# EAGLE design hackspace_con (EAGLE 9.6.2)
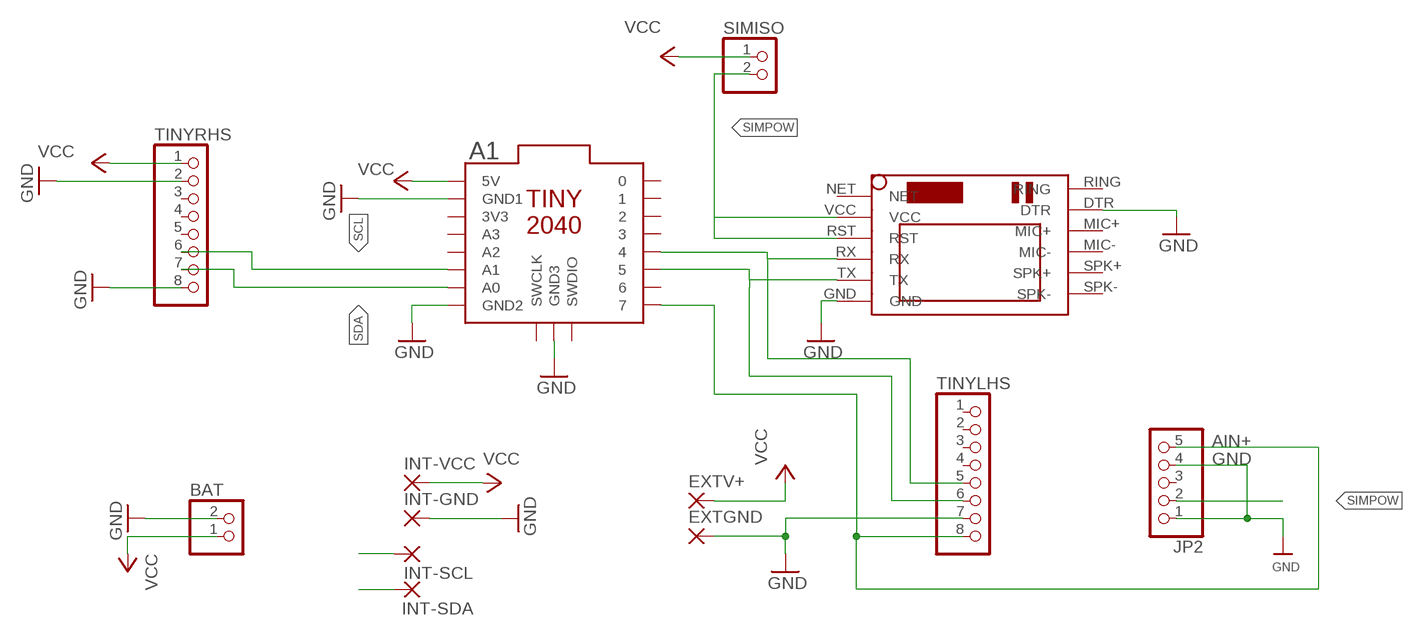
[diagram p0: schematic, sheet 1]

## Parts
A1  TINY2040  [TINY2040]
BAT  JST_2PIN-THM-RA  [JST-PH-2-THM-RA]
EXTGND  SMD5  [SMD2,54-5,08]
EXTV+  SMD5  [SMD2,54-5,08]
INT-GND  3,17/1,1  [3,17/1,1]
INT-SCL  3,17/1,1  [3,17/1,1]
INT-SDA  3,17/1,1  [3,17/1,1]
INT-VCC  3,17/1,1  [3,17/1,1]
JP2  HEADER-1X570MIL  [1X05_ROUND_70]
SIMISO  PINHD-1X2  [1X02]
TINYLHS  PINHD-1X8  [1X08]
TINYRHS  PINHD-1X8  [1X08]
U$1  SIM800LMODULE  [SIM800LMODULE]

## Nets
AIN+: A1.7 JP2.5 TINYLHS.8
GND: A1.GND1 A1.GND2 A1.GND3 BAT.2 EXTGND.1(P) INT-GND.1(P) JP2.1 JP2.4 TINYLHS.7 TINYRHS.2 TINYRHS.8 U$1.DTR U$1.GND
RX: A1.4 TINYLHS.5 U$1.RX
SCL: A1.A1 INT-SCL.1(P) TINYRHS.6
SDA: A1.A0 INT-SDA.1(P) TINYRHS.7
SIMPOW: JP2.2 SIMISO.2 U$1.RST U$1.VCC
TX: A1.5 TINYLHS.6 U$1.TX
VCC: A1.5V BAT.1 EXTV+.1(P) INT-VCC.1(P) SIMISO.1 TINYRHS.1
Unconnected: A1.0 A1.1 A1.2 A1.3 A1.3V3 A1.6 A1.A2 A1.A3 A1.SWCLK A1.SWDIO JP2.3 TINYLHS.1 TINYLHS.2 TINYLHS.3 TINYLHS.4 TINYRHS.3 TINYRHS.4 TINYRHS.5 U$1.MIC+ U$1.MIC- U$1.NET U$1.RING U$1.SPK+ U$1.SPK-

## Library data of the parts
A1 = pimoroni-boards:TINY2040
BAT = adafruit:JST_2PIN: JST 2-Pin Connectors of various flavors SMT-RA (S2B-PH-SM4) 4UConnector #17311 SMT (B2B-PH-SM4) THM-RA (S2B-PH) THM (B2B-PH)
EXTGND EXTV+ = wirepad:SMD5: SMD PAD
INT-GND INT-SCL INT-SDA INT-VCC = wirepad:3,17/1,1: THROUGH-HOLE PAD
JP2 = microbuilder:HEADER-1X5: PIN HEADER
SIMISO = pinhead:PINHD-1X2: PIN HEADER
TINYLHS TINYRHS = pinhead:PINHD-1X8: PIN HEADER
U$1 = SIM800LMODULE:SIM800LMODULE: SIM800L Module

## Board
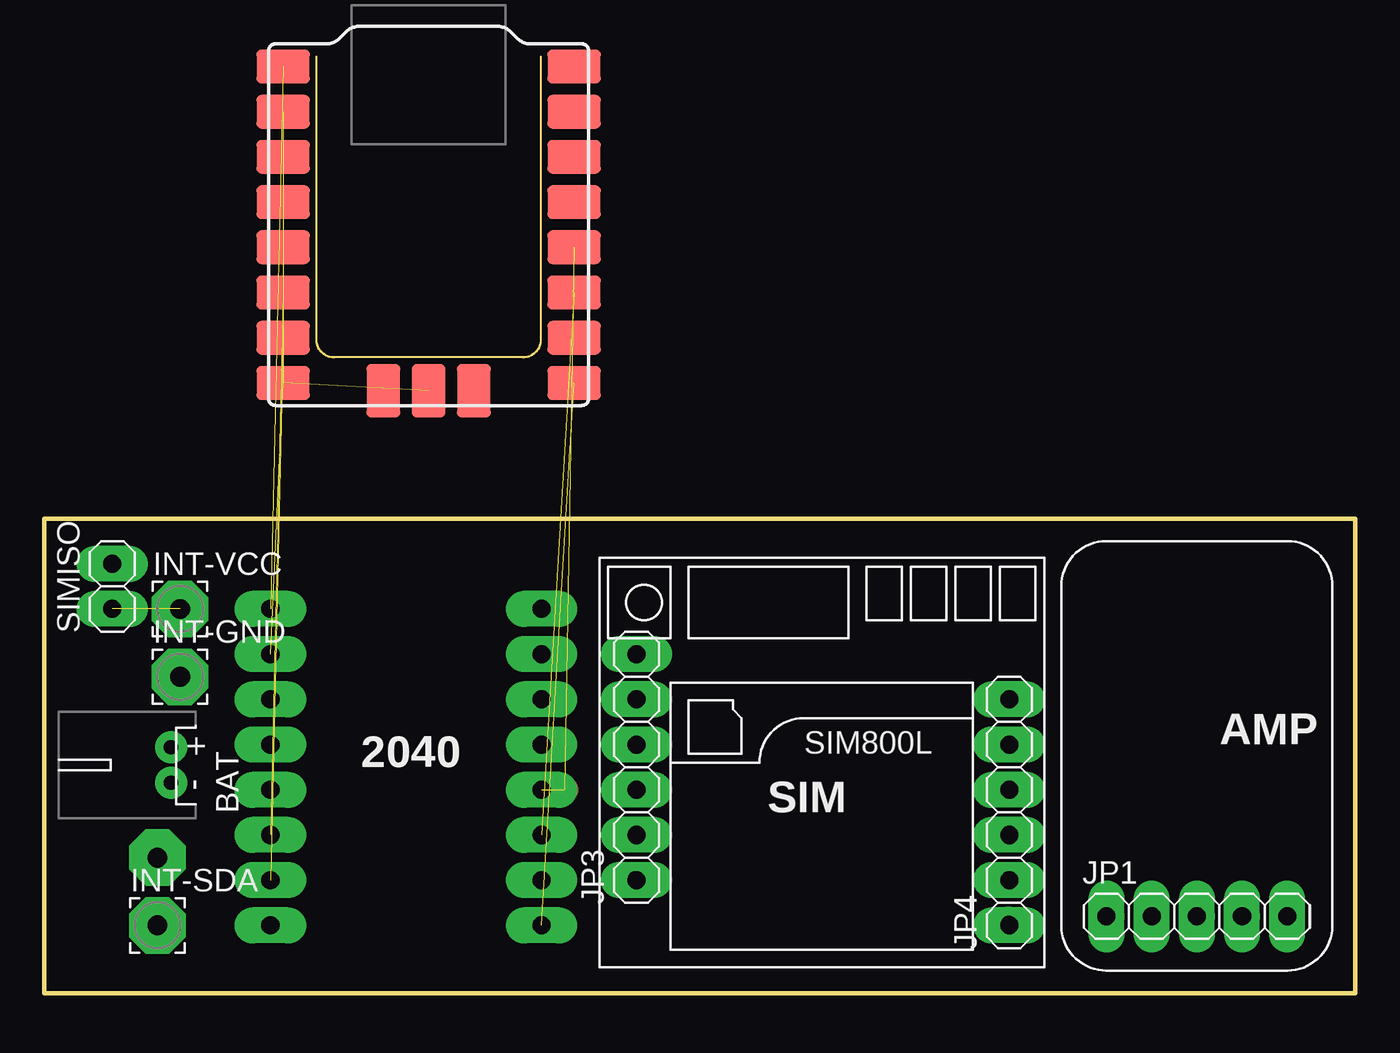
[diagram p1: board, top side]
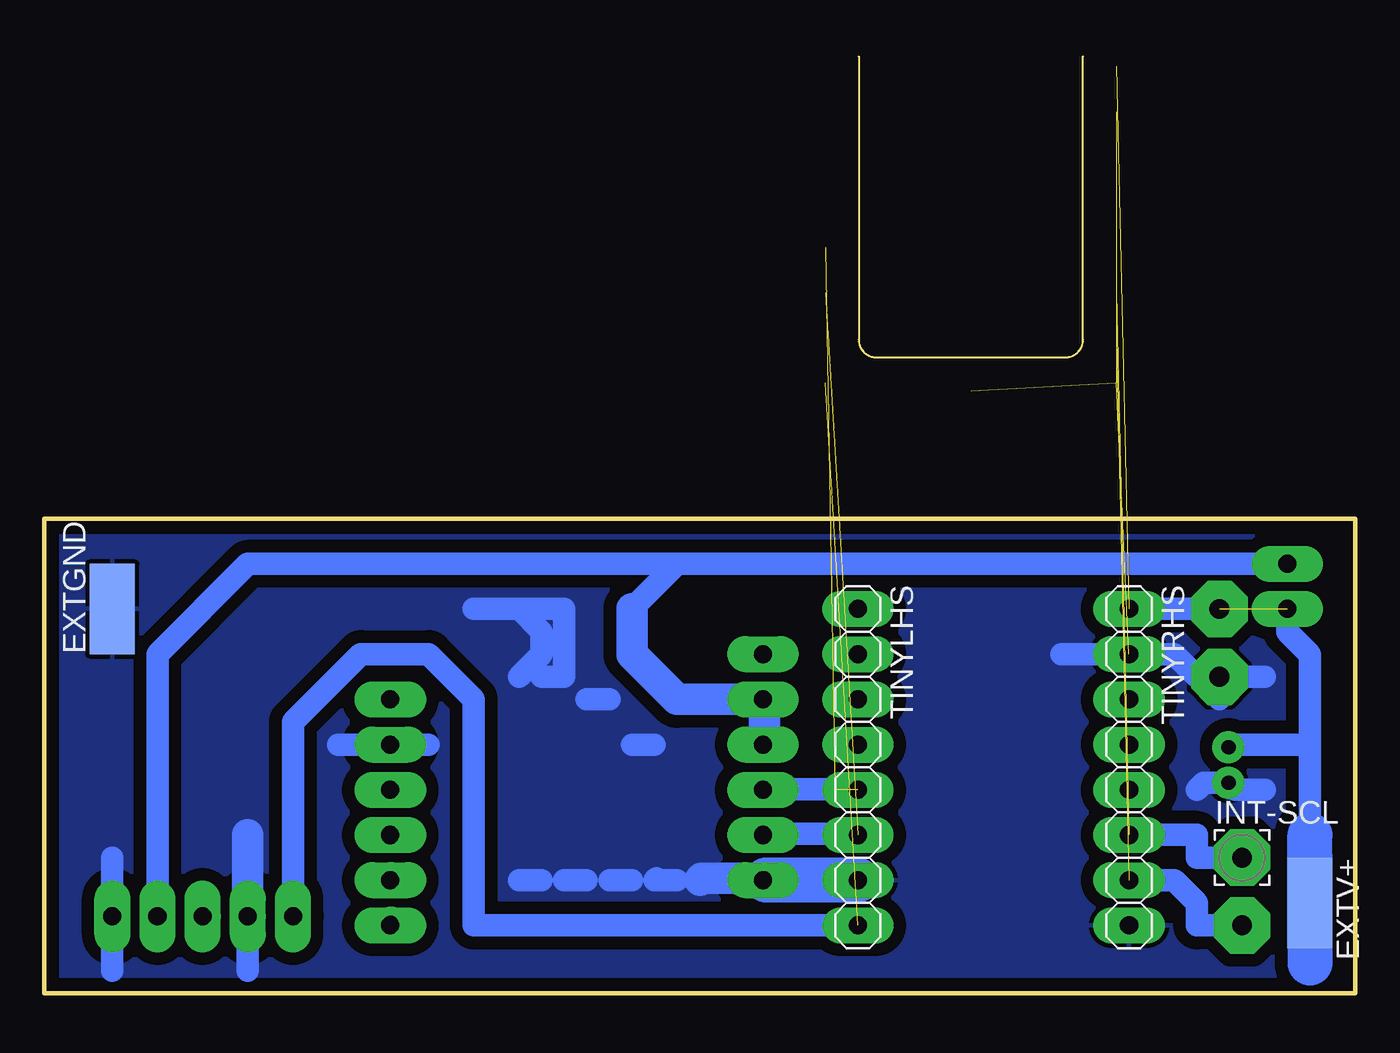
[diagram p2: board, bottom side, seen from below]

Size 73.66 x 26.67 mm. Coordinates in mm from the lower left corner, seen from the top.
Outline: 0,26.67 0,0 73.66,0 73.66,26.67 0,26.67
Copper layers (1*16): Top 0.035mm / dielectric 1.5mm / Bottom 0.035mm
Design rules "aisler_2_layer_simple *": minimum track width 0.1mm, minimum drill 0.3mm, track to track 0.1mm, track to pad 0.1mm, pad to pad 0.1mm, via to via 0.1mm, smd to smd 0.1mm, copper to edge 0.3mm, drill to drill 0.25mm, minimum pad ring 0.5mm, minimum via ring 0.2mm, stop-mask expansion 0mil, vias tented up to drill 0mil, thermal gap 10mil

### Footprints (pad centres in the part's own frame; a part is rotated, then mirrored left to right if it is on the bottom)
TINY2040 = smd 1.9 x 3: 0 1.27,8.17; 1 3.81,8.17; 2 6.35,8.17; 3 8.89,8.17; 3V3 6.35,-8.17; 4 11.43,8.17; 5 13.97,8.17; 5V 1.27,-8.17; 6 16.51,8.17; 7 19.05,8.17; A0 16.51,-8.17; A1 13.97,-8.17; A2 11.43,-8.17; A3 8.89,-8.17; GND1 3.81,-8.17; GND2 19.05,-8.17 | smd 3 x 1.9: GND3 19.49,0; SWCLK 19.49,-2.54; SWDIO 19.49,2.54
JST-PH-2-THM-RA = drill 0.8 pad 1.422: 1 1,0; 2 -1,0
SMD2,54-5,08 = smd 2.54 x 5.08: 1 0,0
3,17/1,1 = drill 1.118 pad 3.175 octagon: 1 0,0
1X05 = drill 1.016 long: 1 -5.08,0; 2 -2.54,0; 3 0,0; 4 2.54,0; 5 5.08,0
1X05_ROUND_70 = drill 1 pad 1.778 square: 1 -5.08,0 | drill 1 pad 1.778: 2 -2.54,0; 3 0,0; 4 2.54,0; 5 5.08,0
1X06 = drill 1.016 long: 1 -6.35,0; 2 -3.81,0; 3 -1.27,0; 4 1.27,0; 5 3.81,0; 6 6.35,0
1X02 = drill 1.016 long: 1 -1.27,0; 2 1.27,0
1X08 = drill 1.016 long: 1 -8.89,0; 2 -6.35,0; 3 -3.81,0; 4 -1.27,0; 5 1.27,0; 6 3.81,0; 7 6.35,0; 8 8.89,0
SIM800LMODULE = drill 0.8: DTR 10.5,1; GND -10.5,-6.5; MIC+ 10.5,-1.5; MIC- 10.5,-4; RST -10.5,1; RX -10.5,-1.5; SPK+ 10.5,-6.5; SPK- 10.5,-9; TX -10.5,-4; VCC -10.5,3.5 | drill 0.8 square: NET -10.5,6; RING 10.5,3.5

### Placement (x,y rotation side)
A1  21.59,53.34 270 top  (outside the outline)
BAT  7.11,12.83 90 top
EXTGND  69.85,21.59 0 bottom
EXTV+  2.54,5.08 180 bottom
INT-GND  7.62,17.78 0 top
INT-SCL  6.35,7.62 0 bottom
INT-SDA  6.35,3.81 0 top
INT-VCC  7.62,21.59 0 top
JP1  [1X05]  64.77,4.32 0 top
JP2  64.77,4.32 180 top
JP3  [1X06]  33.27,12.7 90 top
JP4  [1X06]  54.23,10.16 90 top
SIMISO  3.81,22.86 90 top
TINYLHS  27.94,12.7 270 bottom
TINYRHS  12.7,12.7 270 bottom
U$1  43.69,12.95 0 top

### Tracks (layer width: path | path; a pad name or v marks a point on that pad's centre or on a via)
AIN+  (1 unrouted)
  Bottom 1.27: JP2.5 59.69,15.24 55.88,19.05 52.07,19.05 49.53,16.51 49.53,3.81 TINYLHS.8
GND  (3 unrouted)
  Bottom 1.27: JP2.4 62.23,5.08 | JP2.4 62.23,2.54 | U$1.GND 33.08,6.35 31.75,6.35 | 5.08,11.43 6.71,11.43 BAT.2 8.49,11.83 8.89,11.43 | 16.51,19.05 TINYRHS.2 10.16,19.05 8.89,17.78 INT-GND.1 | INT-GND.1 5.08,17.78 | INT-GND.1 7.62,16.51 | 52.07,13.97 52.09,13.95 U$1.DTR 54.2,13.97 57.15,13.97 | JP2.4 62.23,1.27 | 69.85,1.27 JP2.1 69.85,7.62 | 46.99,21.59 45.72,20.32 45.72,19.05 46.99,17.78 | 46.99,21.59 49.53,21.59 | 46.99,6.35 45.72,6.35 | 45.72,17.78 44.45,17.78 44.45,21.59 46.99,21.59 | 44.45,6.35 43.18,6.35 | 43.18,16.51 41.91,16.51 | 41.91,6.35 40.64,6.35 | 40.64,13.97 39.37,13.97 | 38.1,6.35 39.37,6.35 39.27,6.45
  Bottom 1.778: U$1.GND 36.73,6.45 36.83,6.35 | 62.23,5.08 62.23,8.89
  Bottom 2.54: TINYLHS.7 33.08,6.35
  pour Bottom (isolate 0.711): 0,26.67 0,0 73.66,0 73.66,26.67
RX  (2 unrouted)
  Top 1.524: 29.23,11.45 29.21,11.43
  Bottom 1.27: TINYLHS.5 27.96,11.45 U$1.RX
SCL  (1 unrouted)
  Bottom 1.27: INT-SCL.1 8.89,7.62 8.89,8.89 TINYRHS.6
SDA  (1 unrouted)
  Bottom 1.27: INT-SDA.1 8.89,3.81 8.89,5.08 10.16,6.35 TINYRHS.7
SIMPOW
  Bottom 1.27: 38.1,16.51 38.04,16.45 U$1.VCC | SIMISO.2 38.1,24.13 | 40.64,21.59 38.1,24.13 | 38.1,24.13 62.23,24.13 67.31,19.05 JP2.2
  Bottom 1.778: U$1.RST U$1.VCC 33.24,16.51 38.1,16.51 40.64,19.05 40.64,21.59
TX  (1 unrouted)
  Top 1.524: 29.82,39.43 A1.5
  Bottom 1.27: TINYLHS.6 28,8.95 U$1.TX
VCC  (2 unrouted)
  Bottom 1.27: EXTV+.1 2.54,7.62 | 2.54,8.89 2.54,13.97 | 2.54,13.97 6.97,13.97 BAT.1 | INT-VCC.1 TINYRHS.1 | SIMISO.1 3.81,20.32 2.54,19.05 2.54,13.97
  Bottom 2.54: 2.54,7.62 2.54,8.89 | EXTV+.1 2.54,1.7

### Text on the board
tPlace: AMP | 2040 | SIM